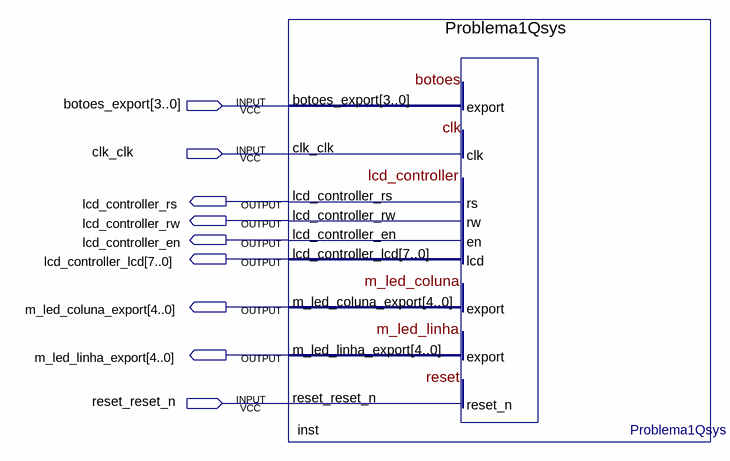
[diagram p0: schematic sheet]
// Quartus schematic Problema1.bdf as structural Verilog: 1 symbols, 9 pins
module Problema1 (
  input  [3:0] botoes_export,
  input  clk_clk,
  input  reset_reset_n,
  output lcd_controller_rs,
  output lcd_controller_rw,
  output lcd_controller_en,
  output [7:0] lcd_controller_lcd,
  output [4:0] m_led_coluna_export,
  output [4:0] m_led_linha_export
);

  Problema1Qsys inst (
    .botoes_export(botoes_export), .clk_clk(clk_clk), .reset_reset_n(reset_reset_n),
    .lcd_controller_rs(lcd_controller_rs), .lcd_controller_rw(lcd_controller_rw),
    .lcd_controller_en(lcd_controller_en), .lcd_controller_lcd(lcd_controller_lcd),
    .m_led_coluna_export(m_led_coluna_export), .m_led_linha_export(m_led_linha_export));
endmodule
